# EAGLE design ir_sensor (EAGLE 6.6.0)
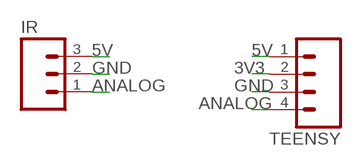
[diagram p0: schematic, sheet 1]

## Parts
IR  M03PTH  [1X03]
TEENSY  M04PTH  [1X04]

## Nets
3V3: TEENSY.2
5V: IR.3 TEENSY.1
ANALOG: IR.1 TEENSY.4
GND: IR.2 TEENSY.3

## Library data of the parts
IR = SparkFun-Connectors:M03: Header 3 Standard 3-pin 0.1" header. Use with straight break away headers (SKU : PRT-00116), right angle break away headers (PRT-00553), swiss pins (PRT-00743), machine pins (PRT-00117), and female headers (PRT-00115). Molex polarized connector foot print use with SKU : PRT-08232 with associated crimp pins and housings.
TEENSY = SparkFun-Connectors:M04: Header 4 Standard 4-pin 0.1" header. Use with straight break away headers (SKU : PRT-00116), right angle break away headers (PRT-00553), swiss pins (PRT-00743), machine pins (PRT-00117), and female headers (PRT-00115). Molex polarized connector foot print use with SKU : PRT-08231 with associated crimp pins and housings. 1MM SMD Version SKU: PRT-10208

## Board
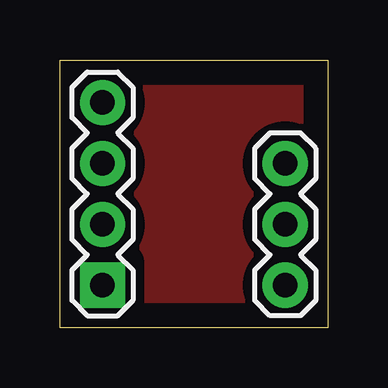
[diagram p1: board, top side]
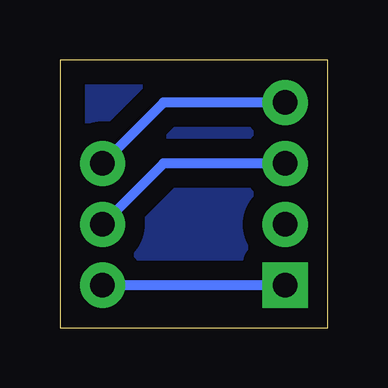
[diagram p2: board, bottom side, seen from below]

Size 11.18 x 11.18 mm. Coordinates in mm from the lower left corner, seen from the top.
Outline: 0,0 0,11.18 11.18,11.18 11.18,0 0,0
Copper layers (1*16): Top 0.035mm / dielectric 1.5mm / Bottom 0.035mm
Design rules "default": minimum track width 10mil, minimum drill 24mil, track to track 8mil, track to pad 8mil, pad to pad 8mil, via to via 8mil, smd to smd 8mil, copper to edge 40mil, drill to drill 8mil, minimum pad ring 10mil, minimum via ring 8mil, stop-mask expansion 4mil, vias tented up to drill 0mil, thermal gap 10mil

### Footprints (pad centres in the part's own frame; a part is rotated, then mirrored left to right if it is on the bottom)
1X03 = drill 1.016 pad 1.88: 1 0,0; 2 2.54,0; 3 5.08,0
1X04 = drill 1.016 pad 1.88 square: 1 0,0 | drill 1.016 pad 1.88: 2 2.54,0; 3 5.08,0; 4 7.62,0

### Placement (x,y rotation side)
IR  9.4,6.86 270 top
TEENSY  1.78,1.78 90 top

### Tracks (layer width: path | path; a pad name or v marks a point on that pad's centre or on a via)
5V
  Bottom 0.406: TEENSY.1 IR.3
ANALOG
  Bottom 0.406: TEENSY.4 6.86,9.4 IR.1
GND
  Bottom 0.406: TEENSY.3 6.86,6.86 IR.2
N$1
  pour Top (isolate 0.813): 0,11.43 11.43,11.43 11.43,0 0,0
N$2
  pour Bottom (isolate 0.813): 0,11.43 11.43,11.43 11.43,0 0,0